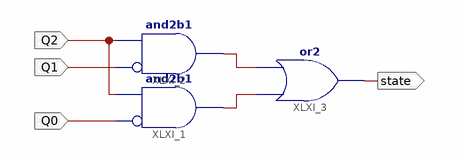
[diagram p0: schematic sheet 1]
// Xilinx ISE schematic StateAdd.sch (spartan3e) as structural Verilog: 3 symbols, 4 ports
module StateAdd (
  input  Q1,
  input  Q2,
  input  Q0,
  output state
);

  wire XLXN_28, XLXN_29;

  and XLXI_1 (XLXN_29, ~Q0, Q2);  // and2b1
  and XLXI_2 (XLXN_28, ~Q1, Q2);  // and2b1
  or XLXI_3 (state, XLXN_29, XLXN_28);
endmodule
